# EAGLE design goofylite (EAGLE 6.5.0)
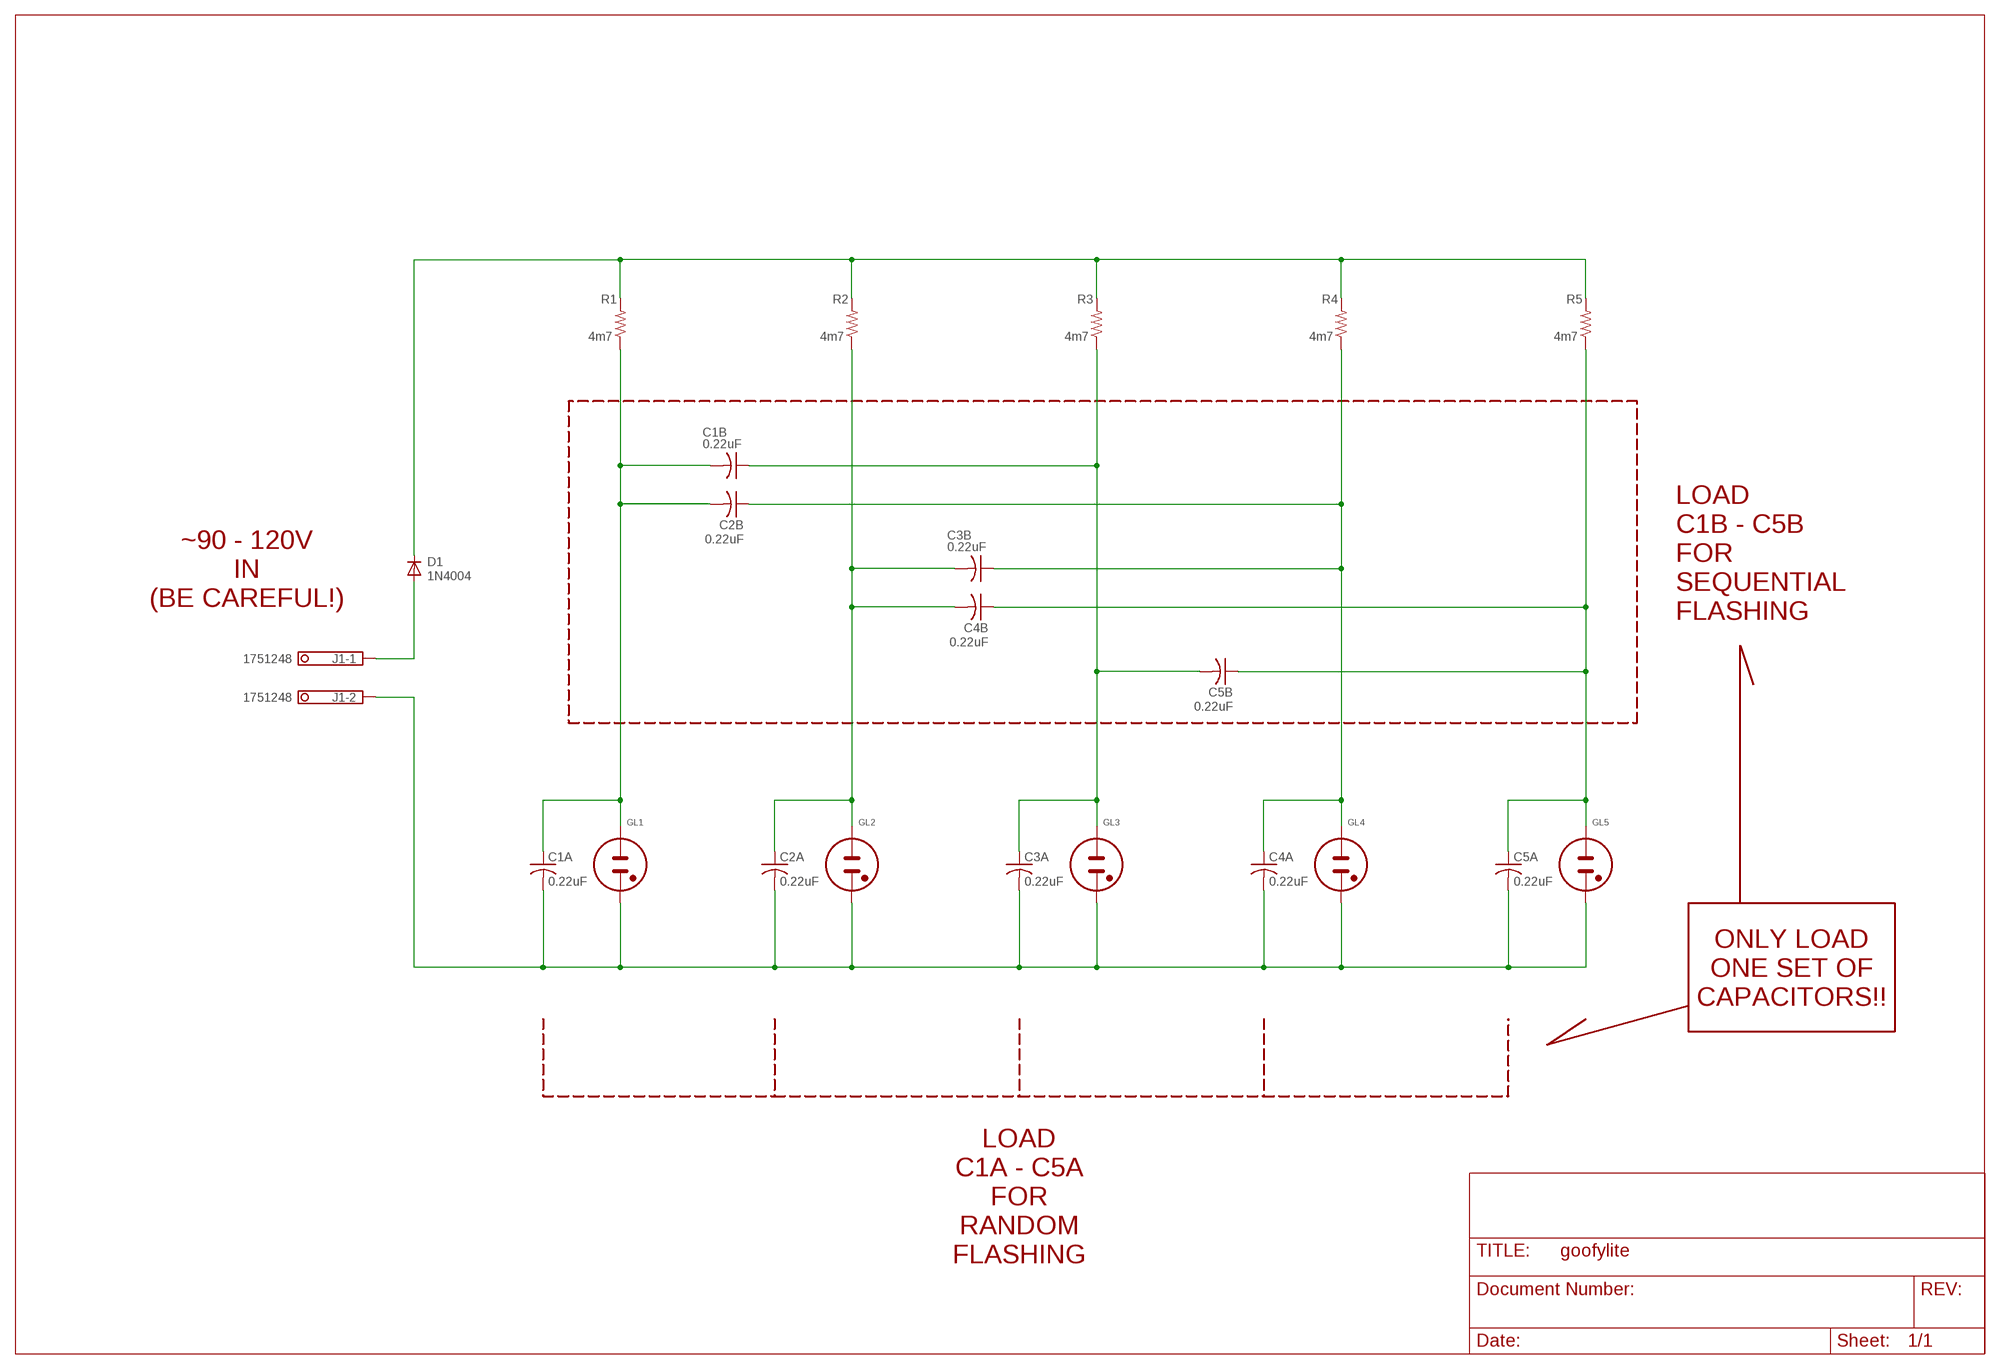
[diagram p0: schematic, sheet 1]

## Parts
C1A  0.22uF  C-US150-054X183  [C150-054X183]
C1B  0.22uF  C-US150-054X183  [C150-054X183]
C2A  0.22uF  C-US150-054X183  [C150-054X183]
C2B  0.22uF  C-US150-054X183  [C150-054X183]
C3A  0.22uF  C-US150-054X183  [C150-054X183]
C3B  0.22uF  C-US150-054X183  [C150-054X183]
C4A  0.22uF  C-US150-054X183  [C150-054X183]
C4B  0.22uF  C-US150-054X183  [C150-054X183]
C5A  0.22uF  C-US150-054X183  [C150-054X183]
C5B  0.22uF  C-US150-054X183  [C150-054X183]
D1  1N4004  [DO41-10]
GL1  NE2-NEON-BULB-DRILL  [NE2-NEON-BULB-DRILL]
GL2  NE2-NEON-BULB-DRILL  [NE2-NEON-BULB-DRILL]
GL3  NE2-NEON-BULB-DRILL  [NE2-NEON-BULB-DRILL]
GL4  NE2-NEON-BULB-DRILL  [NE2-NEON-BULB-DRILL]
GL5  NE2-NEON-BULB-DRILL  [NE2-NEON-BULB-DRILL]
J1  1751248  [1751248]
R1  4m7  R-US_0204/7  [0204/7]
R2  4m7  R-US_0204/7  [0204/7]
R3  4m7  R-US_0204/7  [0204/7]
R4  4m7  R-US_0204/7  [0204/7]
R5  4m7  R-US_0204/7  [0204/7]

## Nets
N$1: C1A.1 C1B.2 C2B.2 GL1.1(A) R1.1
N$2: D1.C R1.2 R2.2 R3.2 R4.2 R5.2
N$3: C2A.1 C3B.2 C4B.2 GL2.1(A) R2.1
N$4: C1A.2 C2A.2 C3A.2 C4A.2 C5A.2 GL1.2(A1) GL2.2(A1) GL3.2(A1) GL4.2(A1) GL5.2(A1) J1.2
N$5: C1B.1 C3A.1 C5B.2 GL3.1(A) R3.1
N$6: C2B.1 C3B.1 C4A.1 GL4.1(A) R4.1
N$7: C4B.1 C5A.1 C5B.1 GL5.1(A) R5.1
N$8: D1.A J1.1

## Notes on the sheet
- ~90 - 120V
  IN
  (BE CAREFUL!)
- LOAD
  C1B - C5B
  FOR
  SEQUENTIAL
  FLASHING
- ONLY LOAD
  ONE SET OF
  CAPACITORS!!
- LOAD
  C1A - C5A
  FOR
  RANDOM
  FLASHING

## Library data of the parts
C1A C1B C2A C2B C3A C3B C4A C4B C5A C5B = rcl:C-US: CAPACITOR, American symbol
D1 = diode:1N4004: DIODE general purpose rectifier, 1 A
GL1-GL5 = nixie_tube:NE2-NEON-BULB: Neon indicator (wire connection)
J1 = con-phoenix-350:1751248: MKDS 1/ 2-3,5 Printklemme Nennstrom: 10 A Bemessungsspannung: 160 V Raster: 3,5 mm Polzahl: 2 Montageart: Löten Anschlussart: Schraubanschluss Anschlussrichtung vom Leiter zur Platine: 0° Source: http://eshop.phoenixcontact.com .. 1751248.pdf; OC_FARNELL: unknown; OC_NEWARK: unknown
R1-R5 = rcl:R-US_: RESISTOR, American symbol

## Board
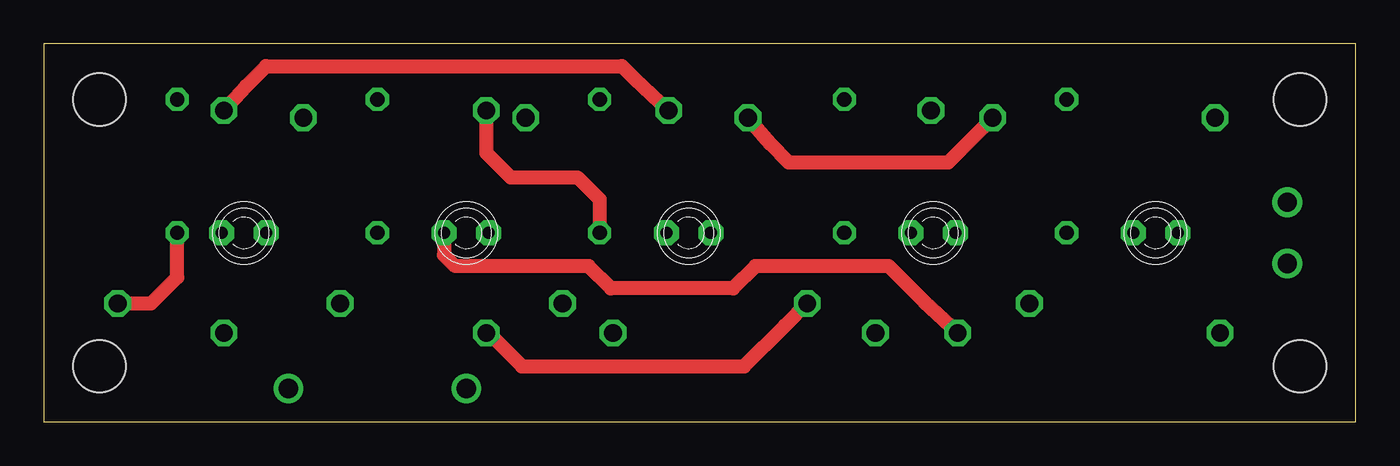
[diagram p1: board, top side]
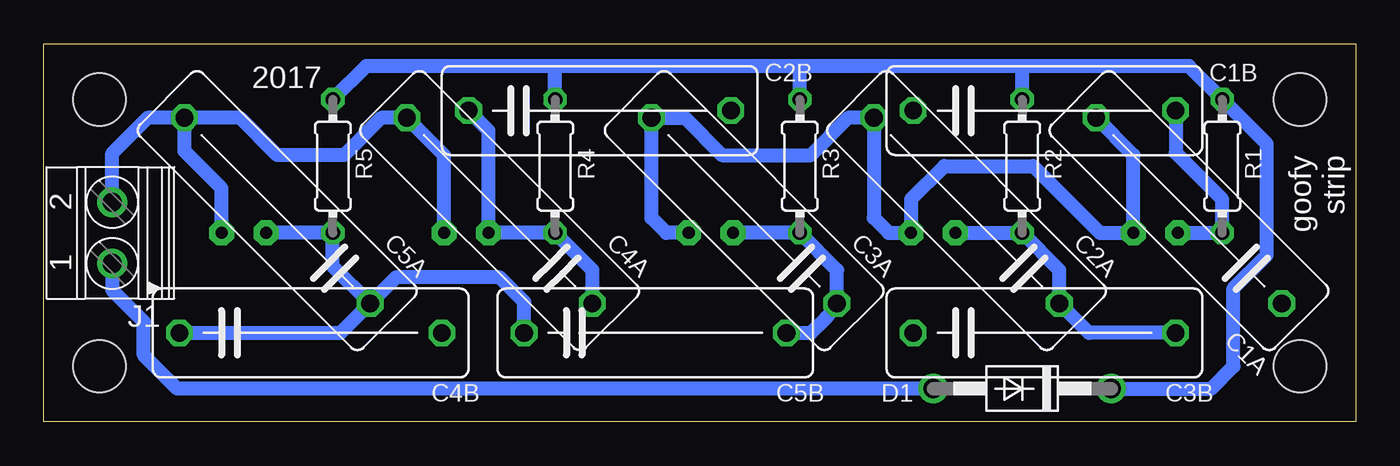
[diagram p2: board, bottom side, seen from below]

Size 74.93 x 21.59 mm. Coordinates in mm from the lower left corner, seen from the top.
Outline: 0,0 74.93,0 74.93,21.59 0,21.59 0,0
Copper layers (1*16): Top 0.035mm / dielectric 1.5mm / Bottom 0.035mm
Design rules "default": minimum track width 10mil, minimum drill 24mil, track to track 8mil, track to pad 8mil, pad to pad 8mil, via to via 8mil, smd to smd 8mil, copper to edge 40mil, drill to drill 8mil, minimum pad ring 10mil, minimum via ring 8mil, stop-mask expansion 4mil, vias tented up to drill 0mil, thermal gap 10mil
Holes 3 mm at 3.17,3.17 71.75,3.17 71.75,18.41 3.17,18.41

### Footprints (pad centres in the part's own frame; a part is rotated, then mirrored left to right if it is on the bottom)
C150-054X183 = drill 1.016 octagon: 1 -7.493,0; 2 7.493,0
DO41-10 = drill 1.118: A 5.08,0; C -5.08,0
NE2-NEON-BULB-DRILL = drill 0.7 pad 1.422 octagon: 1 0,1.27; 2 0,-1.27
1751248 = drill 1.1 pad 1.7: 1 -1.75,-0.1; 2 1.75,-0.1
0204/7 = drill 0.813 octagon: 1 -3.81,0; 2 3.81,0

### Placement (x,y rotation side)
C1A  9.53,12.06 135 bottom
C1B  17.78,17.78 0 bottom
C2A  22.23,12.06 135 bottom
C2B  43.18,17.78 0 bottom
C3A  34.92,12.06 135 bottom
C3B  17.78,5.08 0 bottom
C4A  48.9,12.06 135 bottom
C4B  59.69,5.08 0 bottom
C5A  61.59,12.06 135 bottom
C5B  40.01,5.08 0 bottom
D1  19.05,1.91 180 bottom
GL1  11.43,10.79 90 top
GL2  24.13,10.79 90 top
GL3  36.83,10.79 90 top
GL4  50.8,10.79 90 top
GL5  63.5,10.79 90 top
J1  71.12,10.79 90 bottom
R1  7.62,14.61 90 bottom
R2  19.05,14.61 90 bottom
R3  31.75,14.61 90 bottom
R4  45.72,14.61 90 bottom
R5  58.42,14.61 90 bottom

### Tracks (layer width: path | path; a pad name or v marks a point on that pad's centre or on a via)
N$1
  Top 0.813: C1B.2 11.56,19.18 12.7,20.32 33.02,20.32 33.78,19.56 C2B.2 | C1A.1 6.13,6.77 7.62,8.26 R1.1
  Bottom 0.813: GL1.1 R1.1 7.62,12.7 10.29,15.37 C1B.2
N$2
  Bottom 0.813: 19.05,20.32 9.53,20.32 R1.2 5.08,15.88 5.08,9.53 6.99,7.62 6.99,3.17 8.26,1.91 D1.C | 19.05,20.32 31.75,20.32 | 31.75,20.32 45.72,20.32 | 45.72,20.32 56.52,20.32 R5.2 | R4.2 45.72,20.32 | R3.2 31.75,20.32 | R2.2 19.05,20.32
N$3
  Top 0.813: C4B.2 50.29,6.86 48.26,8.89 40.64,8.89 39.37,7.62 32.38,7.62 31.11,8.89 23.5,8.89 22.86,9.53 GL2.1
  Bottom 0.813: GL2.1 R2.1 16.93,8.67 C2A.1 15.24,5.08 C3B.2
N$4
  Top 0.813: C4A.2 52.92,16.09 51.65,14.82 42.55,14.82 41.49,15.88 C3A.2
  Bottom 0.813: GL3.2 39.37,10.79 40.22,11.65 C3A.2 38.32,17.36 36.2,15.24 31.11,15.24 28.99,17.36 C2A.2 27.52,11.65 26.67,10.79 GL2.2 25.4,12.7 23.5,14.61 18.41,14.61 14.61,10.79 GL1.2 12.7,15.24 C1A.2 | GL4.2 52.07,15.24 C4A.2 55.66,17.36 57.78,15.24 61.59,15.24 63.72,17.36 C5A.2 | GL5.2 64.77,13.34 66.89,15.46 C5A.2 | J1.2 71.02,15.34 69,17.36 C5A.2
N$5
  Top 0.813: C1B.1 25.27,15.37 26.67,13.97 30.48,13.97 31.75,12.7 R3.1
  Bottom 0.813: GL3.1 R3.1 29.63,8.67 C3A.1 30.26,5.93 31.11,5.08 C5B.2
N$6
  Top 0.813: C3B.1 25.4,5.08 27.3,3.17 40.01,3.17 42.33,5.5 C4A.1
  Bottom 0.813: C4A.1 43.6,8.67 R4.1 GL4.1 49.53,16.64 C2B.1
N$7
  Bottom 0.813: GL5.1 R5.1 58.42,8.89 C5A.1 | C4B.1 57.98,5.08 C5A.1 | C5B.1 47.5,6.86 48.9,8.26 54.81,8.26 C5A.1
N$8
  Bottom 0.813: D1.A 67.31,1.91 69.22,3.81 69.22,5.71 71.02,7.52 J1.1

### Text on the board
bPlace: 2017 | goofy / strip